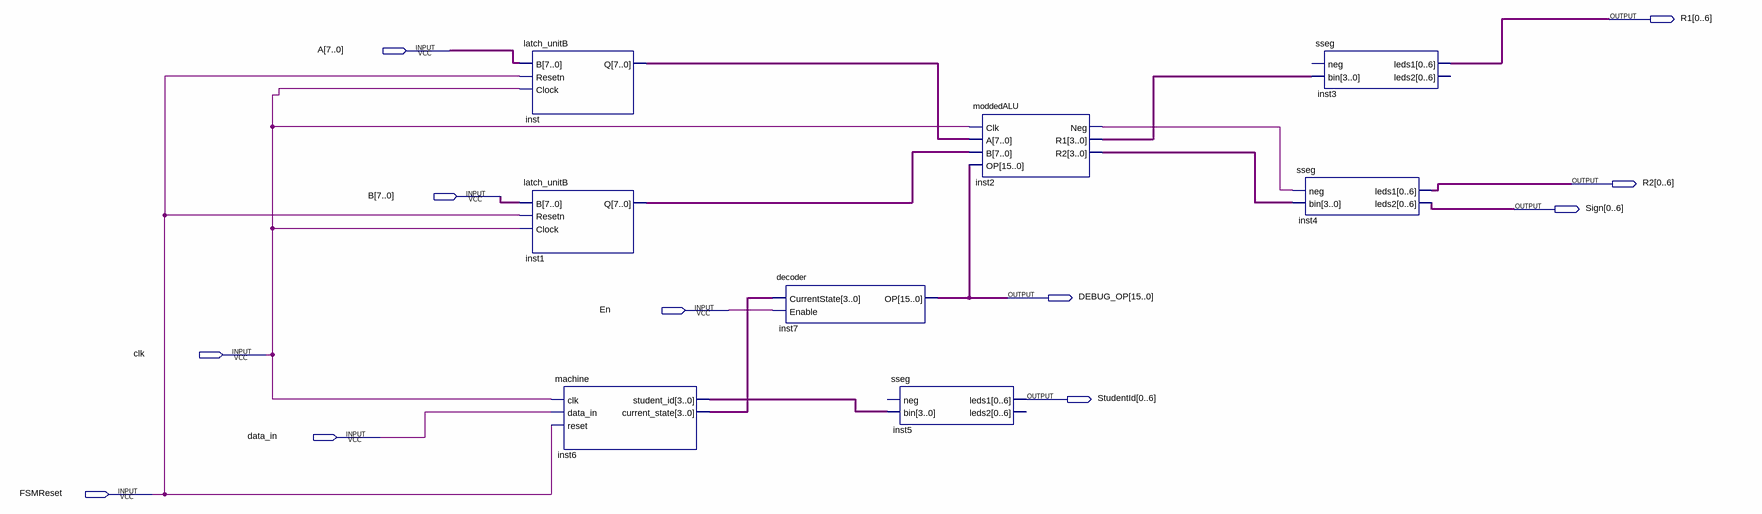
[diagram p0: schematic sheet]
// Quartus schematic Block1.bdf as structural Verilog: 8 symbols, 11 pins
module Block1 (
  input  [7:0] A,
  input  [7:0] B,
  input  En,
  input  clk,
  input  data_in,
  input  FSMReset,
  output [0:6] R1,
  output [0:6] R2,
  output [0:6] Sign,
  output [15:0] DEBUG_OP,
  output [0:6] StudentId
);

  wire inst2_neg;
  wire [3:0] inst2_r1, inst2_r2, inst6_current_state, inst6_student_id;
  wire [7:0] inst1_q, inst_q;

  latch_unitB inst (.B(A), .Resetn(FSMReset), .Clock(clk), .Q(inst_q));
  latch_unitB inst1 (.B(B), .Resetn(FSMReset), .Clock(clk), .Q(inst1_q));
  machine inst6 (
    .clk(clk), .data_in(data_in), .reset(FSMReset), .student_id(inst6_student_id),
    .current_state(inst6_current_state));
  decoder inst7 (.CurrentState(inst6_current_state), .Enable(En), .OP(DEBUG_OP));
  sseg inst5 (.bin(inst6_student_id), .leds1(StudentId));  // open: neg, leds2
  moddedALU inst2 (.Clk(clk), .A(inst_q), .B(inst1_q), .OP(DEBUG_OP), .Neg(inst2_neg), .R1(inst2_r1), .R2(inst2_r2));
  sseg inst4 (.neg(inst2_neg), .bin(inst2_r2), .leds1(R2), .leds2(Sign));
  sseg inst3 (.bin(inst2_r1), .leds1(R1));  // open: neg, leds2
endmodule
